# EAGLE design rfm69hcw-breakout (EAGLE 7.1.0)
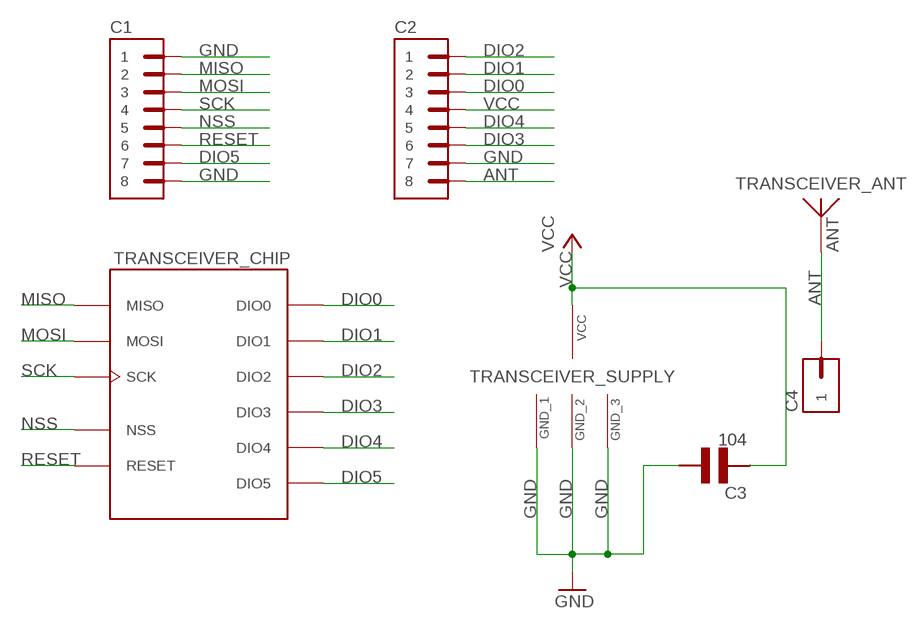
[diagram p0: schematic, sheet 1]

## Parts
C1  PIN_HEADER_8-WIDE  [BREAKAWAY_STRAIGHT_8_WIDE]
C2  PIN_HEADER_8-WIDE  [BREAKAWAY_STRAIGHT_8_WIDE]
C3  104  CAPACITOR-CERAMIC-5MM  [CERAMIC_CAP_5MM]
C4  PIN_HEADER_1-WIDE  [BREAKAWAY_STRAIGHT_1_WIDE]
TRANSCEIVER  RFM69HCW-S2  [HOPE-RF-16]

## Nets
ANT: C2.8 C4.1 TRANSCEIVER.ANT(_ANT:ANT)
DIO0: C2.3 TRANSCEIVER.DIO0(_CHIP:DIO0)
DIO1: C2.2 TRANSCEIVER.DIO1(_CHIP:DIO1)
DIO2: C2.1 TRANSCEIVER.DIO2(_CHIP:DIO2)
DIO3: C2.6 TRANSCEIVER.DIO3(_CHIP:DIO3)
DIO4: C2.5 TRANSCEIVER.DIO4(_CHIP:DIO4)
DIO5: C1.7 TRANSCEIVER.DIO5(_CHIP:DIO5)
GND: C1.1 C1.8 C2.7 C3.P$2 TRANSCEIVER.GND1(_SUPPLY:GND_1) TRANSCEIVER.GND2(_SUPPLY:GND_2) TRANSCEIVER.GND3(_SUPPLY:GND_3)
MISO: C1.2 TRANSCEIVER.MISO(_CHIP:MISO)
MOSI: C1.3 TRANSCEIVER.MOSI(_CHIP:MOSI)
NSS: C1.5 TRANSCEIVER.NSS(_CHIP:NSS)
RESET: C1.6 TRANSCEIVER.RESET(_CHIP:RESET)
SCK: C1.4 TRANSCEIVER.SCK(_CHIP:SCK)
VCC: C2.4 C3.P$1 TRANSCEIVER.3.3V(_SUPPLY:VCC)

## Library data of the parts
C1 C2 = icmi-connectors:PIN_HEADER_8
C3 = icmi-passive-parts:CAPACITOR: Non-polarized capacitor
C4 = icmi-connectors:PIN_HEADER_1
TRANSCEIVER = icmi-custom-parts:RFM69HCW: HopeRF RFM69HCW ISM Transceiver Module The RFM69HCW <http://www.hoperf.com/rf/fsk_module/RFM69HCW.htm> is a transceiver module capable of operation over a wide frequency range, including the 315,433,868 and 915MHz license-free ISM (Industry Scientific and Medical) frequency bands. All major RF communication parameters are programmable and most of them can be dynamically set. The RFM69HCW offers the unique advantage of programmable narrow-band and wide- band communication modes. The RFM69HCW is optimized for low power consumption while offering high RF output power and channelized operation. Compliance ETSI and FCC regulations. In order to better use RFM69HCW modules, this specification also involves a large number of the parameters and functions of its core chip RF69H's,including those IC pins which are not leaded out. All of these can help customers gain a better understanding of the performance of RFM69HCW modules, and enhance the application skills.

## Board
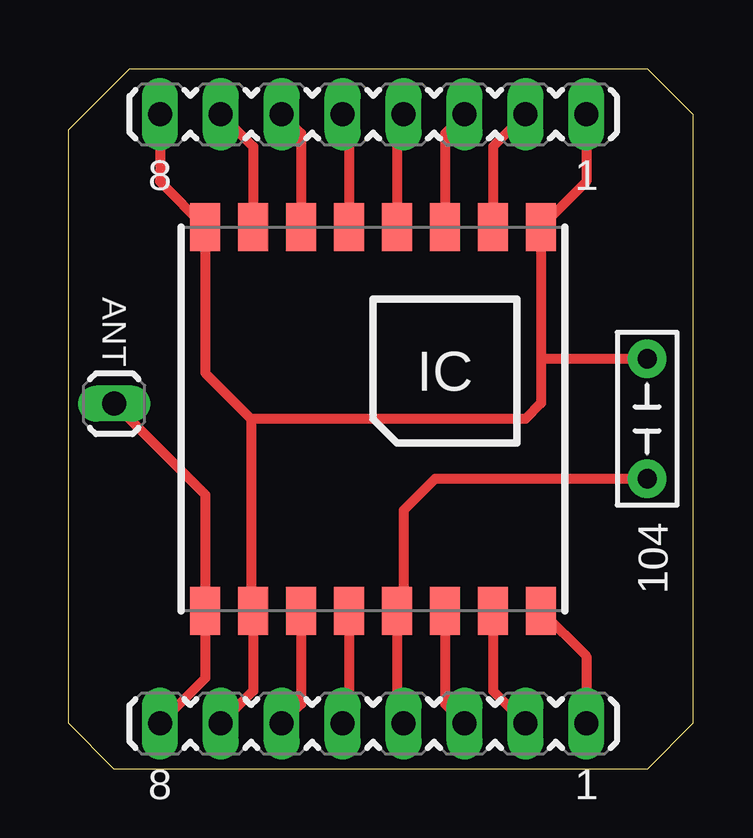
[diagram p1: board, top side]

Size 26.04 x 29.21 mm. Coordinates in mm from the lower left corner, seen from the top.
Outline: 2.54,29.21 24.13,29.21 26.04,27.31 26.04,1.91 24.13,0 1.91,0 0,1.91 0,26.67 2.54,29.21
Copper layers (1*16): Top 0.035mm / dielectric 1.5mm / Bottom 0.035mm
Design rules "default": minimum track width 10mil, minimum drill 24mil, track to track 8mil, track to pad 8mil, pad to pad 8mil, via to via 8mil, smd to smd 8mil, copper to edge 40mil, drill to drill 8mil, minimum pad ring 10mil, minimum via ring 8mil, stop-mask expansion 4mil, vias tented up to drill 0mil, thermal gap 10mil

### Footprints (pad centres in the part's own frame; a part is rotated, then mirrored left to right if it is on the bottom)
BREAKAWAY_STRAIGHT_8_WIDE = drill 1 long: 1 0,-8.89; 2 0,-6.35; 3 0,-3.81; 4 0,-1.27; 5 0,1.27; 6 0,3.81; 7 0,6.35; 8 0,8.89
CERAMIC_CAP_5MM = drill 0.8 pad 1.6: P$1 -2.5,0; P$2 2.5,0
BREAKAWAY_STRAIGHT_1_WIDE = drill 1 long: 1 0,0
HOPE-RF-16 = smd 1.25 x 2: 3.3V 1,-8; ANT -7,-8; DIO0 3,-8; DIO1 5,-8; DIO2 7,-8; DIO3 -3,-8; DIO4 -1,-8; DIO5 -5,8; GND1 7,8; GND2 -7,8; GND3 -5,-8; MISO 5,8; MOSI 3,8; NSS -1,8; RESET -3,8; SCK 1,8

### Placement (x,y rotation side)
C1  12.7,27.31 90 top
C2  12.7,1.91 90 top
C3  24.13,14.61 90 top
C4  1.91,15.24 180 top
TRANSCEIVER  12.7,14.61 0 top

### Tracks (layer width: path | path; a pad name or v marks a point on that pad's centre or on a via)
ANT
  Top 0.406: C2.8 5.7,3.8 TRANSCEIVER.ANT 5.7,11.45 C4.1
DIO0
  Top 0.406: TRANSCEIVER.DIO0 15.7,2.72 C2.3
DIO1
  Top 0.406: TRANSCEIVER.DIO1 17.7,3.26 C2.2
DIO2
  Top 0.406: TRANSCEIVER.DIO2 21.59,4.72 C2.1
DIO3
  Top 0.406: TRANSCEIVER.DIO3 9.7,2.72 C2.6
DIO4
  Top 0.406: TRANSCEIVER.DIO4 11.7,2.18 C2.5
DIO5
  Top 0.406: C1.7 7.7,25.95 TRANSCEIVER.DIO5
GND
  Top 0.406: C1.8 3.81,24.5 TRANSCEIVER.GND2 5.7,16.53 7.62,14.61 | C1.1 21.59,24.5 TRANSCEIVER.GND1 19.7,17.15 | 7.62,14.61 7.62,6.69 TRANSCEIVER.GND3 7.7,3.26 C2.7 | 19.7,17.15 19.7,15.26 19.05,14.61 7.62,14.61 | C3.P$2 19.74,17.11 19.7,17.15
MISO
  Top 0.406: C1.2 17.7,25.95 TRANSCEIVER.MISO
MOSI
  Top 0.406: C1.3 15.7,26.5 TRANSCEIVER.MOSI
NSS
  Top 0.406: C1.5 11.7,27.03 TRANSCEIVER.NSS
RESET
  Top 0.406: C1.6 9.7,26.5 TRANSCEIVER.RESET
SCK
  Top 0.406: C1.4 13.7,27.03 TRANSCEIVER.SCK
VCC
  Top 0.406: C2.4 13.7,2.18 TRANSCEIVER.3.3V 13.97,6.88 13.97,10.8 15.28,12.11 C3.P$1

### Text on the board
tNames: ANT
bNames: GND | DIO5 | RESET | NSS | SCK | MOSI | MISO | GND | ANT | ICMI RFM69 | v1.0 | https://github.com/hmbusch | ANT | GND | DIO3 | DIO4 | 3.3V | DIO0 | DIO1 | DIO2